# EAGLE board PIO-Dev-3 (EAGLE 9.5.2), part 1 of 2
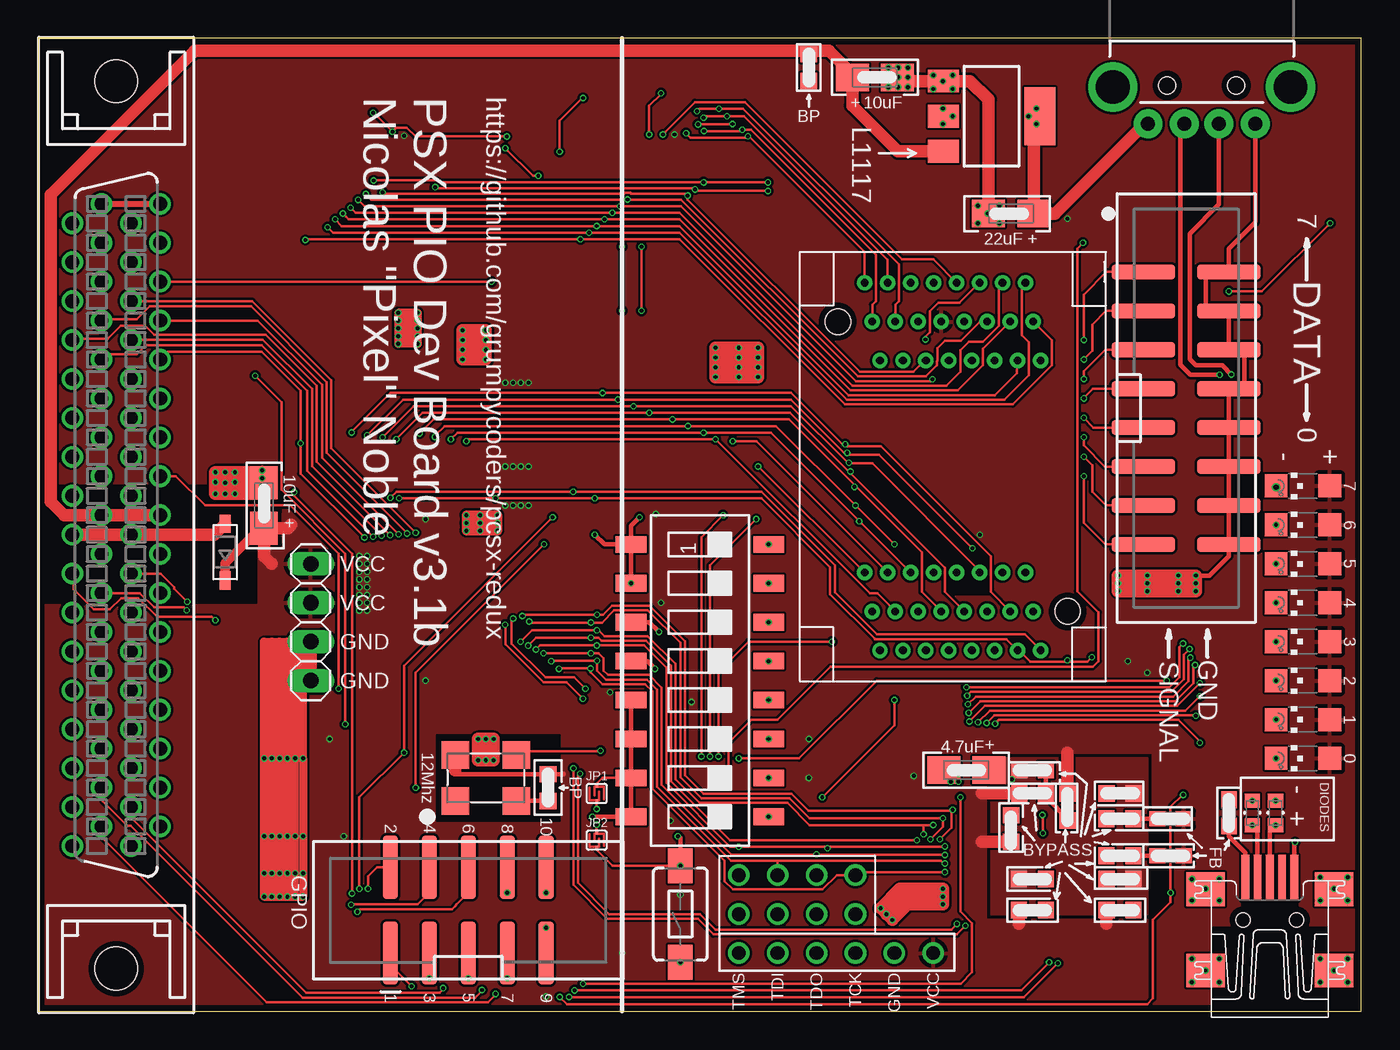
[diagram p3: board, top side]
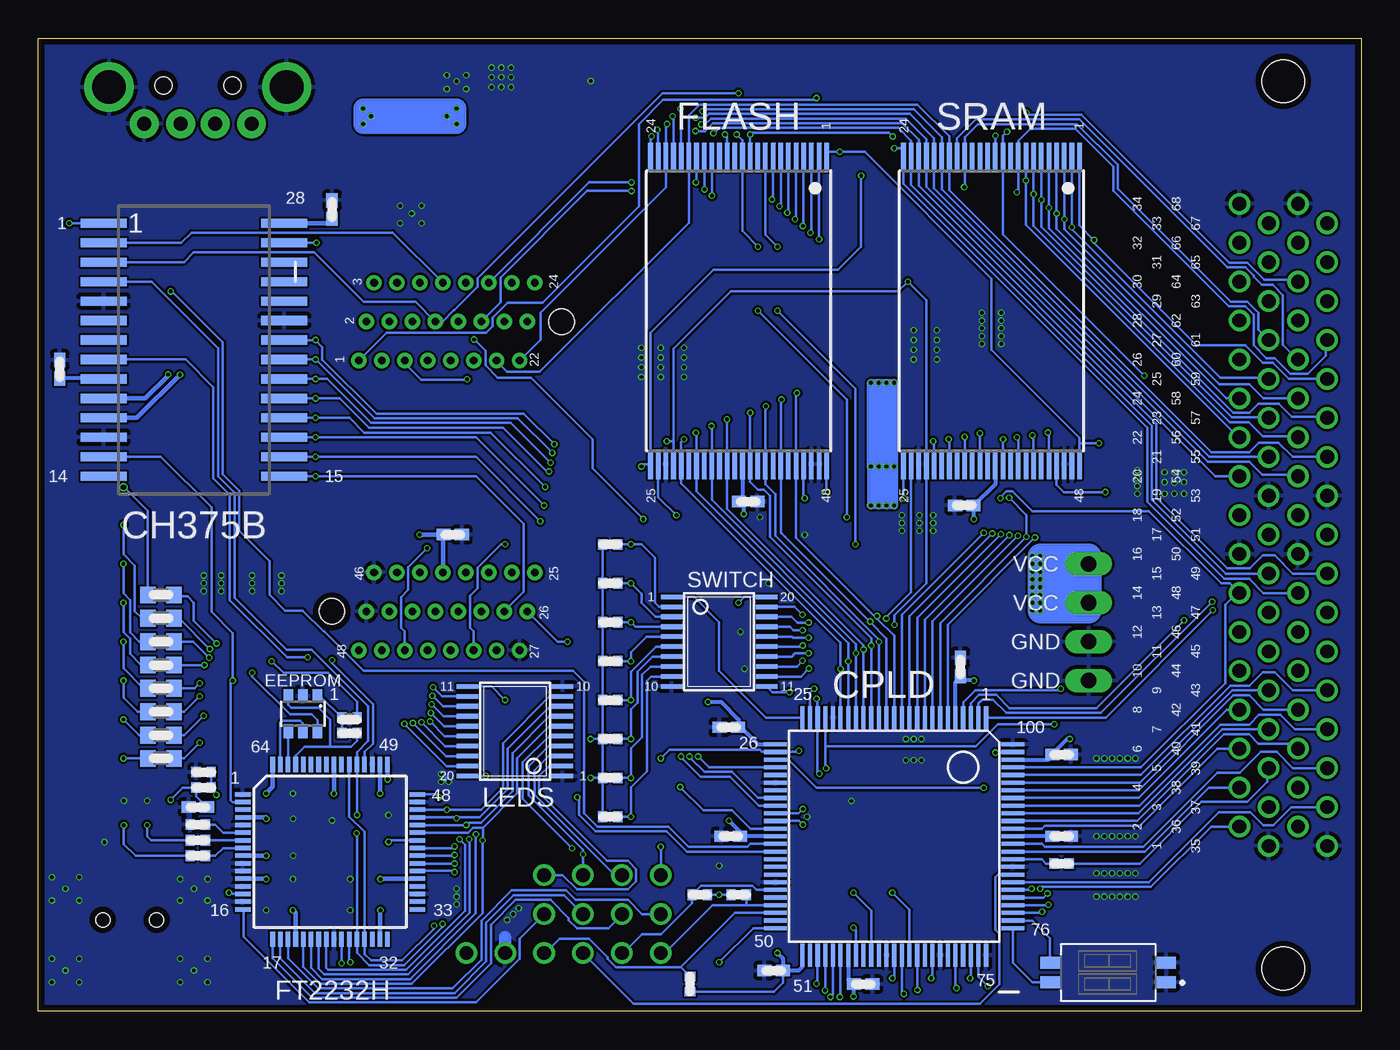
[diagram p4: board, bottom side, seen from below]

Size 86.36 x 63.5 mm. Coordinates in mm from the lower left corner, seen from the top.
Outline: 0,0 86.36,0 86.36,63.5 0,63.5 0,0
Copper layers (1*16): Top 0.035mm / dielectric 1.6mm / Bottom 0.035mm
Design rules "default *": minimum track width 6mil, minimum drill 0.2mm, track to track 6mil, track to pad 6mil, pad to pad 6mil, via to via 6mil, smd to smd 0mil, copper to edge 0.4mm, drill to drill 6mil, minimum pad ring 10mil, minimum via ring 3mil, stop-mask expansion 4mil, vias tented up to drill 25mil, thermal gap 10mil

## Footprints (pad centres in the part's own frame; a part is rotated, then mirrored left to right if it is on the bottom)
C0402K = smd 0.925 x 0.74: 1 -0.6,0; 2 0.6,0
A/3216-18W = smd 2.15 x 1.8: + 1.475,0; - -1.475,0
C0603K = smd 1.05 x 1.08: 1 -0.875,0; 2 0.875,0
SOP28-LL = smd 0.6 x 3: 1 -8.255,-5.9; 2 -6.985,-5.9; 3 -5.715,-5.9; 4 -4.445,-5.9; 5 -3.175,-5.9; 6 -1.905,-5.9; 7 -0.635,-5.9; 8 0.635,-5.9; 9 1.905,-5.9; 10 3.175,-5.9; 11 4.445,-5.9; 12 5.715,-5.9; 13 6.985,-5.9; 14 8.255,-5.9; 15 8.255,5.9; 16 6.985,5.9; 17 5.715,5.9; 18 4.445,5.9; 19 3.175,5.9; 20 1.905,5.9; 21 0.635,5.9; 22 -0.635,5.9; 23 -1.905,5.9; 24 -3.175,5.9; 25 -4.445,5.9; 26 -5.715,5.9; 27 -6.985,5.9; 28 -8.255,5.9
TQFP100 = smd 0.27 x 1.5: 1 -6,-7.75; 2 -5.5,-7.75; 3 -5,-7.75; 4 -4.5,-7.75; 5 -4,-7.75; 6 -3.5,-7.75; 7 -3,-7.75; 8 -2.5,-7.75; 9 -2,-7.75; 10 -1.5,-7.75; 11 -1,-7.75; 12 -0.5,-7.75; 13 0,-7.75; 14 0.5,-7.75; 15 1,-7.75; 16 1.5,-7.75; 17 2,-7.75; 18 2.5,-7.75; 19 3,-7.75; 20 3.5,-7.75; 21 4,-7.75; 22 4.5,-7.75; 23 5,-7.75; 24 5.5,-7.75; 25 6,-7.75; 51 6,7.75; 52 5.5,7.75; 53 5,7.75; 54 4.5,7.75; 55 4,7.75; 56 3.5,7.75; 57 3,7.75; 58 2.5,7.75; 59 2,7.75; 60 1.5,7.75; 61 1,7.75; 62 0.5,7.75; 63 0,7.75; 64 -0.5,7.75; 65 -1,7.75; 66 -1.5,7.75; 67 -2,7.75; 68 -2.5,7.75; 69 -3,7.75; 70 -3.5,7.75; 71 -4,7.75; 72 -4.5,7.75; 73 -5,7.75; 74 -5.5,7.75; 75 -6,7.75 | smd 1.5 x 0.27: 26 7.75,-6; 27 7.75,-5.5; 28 7.75,-5; 29 7.75,-4.5; 30 7.75,-4; 31 7.75,-3.5; 32 7.75,-3; 33 7.75,-2.5; 34 7.75,-2; 35 7.75,-1.5; 36 7.75,-1; 37 7.75,-0.5; 38 7.75,0; 39 7.75,0.5; 40 7.75,1; 41 7.75,1.5; 42 7.75,2; 43 7.75,2.5; 44 7.75,3; 45 7.75,3.5; 46 7.75,4; 47 7.75,4.5; 48 7.75,5; 49 7.75,5.5; 50 7.75,6; 76 -7.75,6; 77 -7.75,5.5; 78 -7.75,5; 79 -7.75,4.5; 80 -7.75,4; 81 -7.75,3.5; 82 -7.75,3; 83 -7.75,2.5; 84 -7.75,2; 85 -7.75,1.5; 86 -7.75,1; 87 -7.75,0.5; 88 -7.75,0; 89 -7.75,-0.5; 90 -7.75,-1; 91 -7.75,-1.5; 92 -7.75,-2; 93 -7.75,-2.5; 94 -7.75,-3; 95 -7.75,-3.5; 96 -7.75,-4; 97 -7.75,-4.5; 98 -7.75,-5; 99 -7.75,-5.5; 100 -7.75,-6
WE-VE_0603 = smd 0.9 x 1: 1 -0.8,0; 2 0.8,0
SOD-123 = smd 1.2 x 0.7: A 1.85,0; C -1.85,0
SOT23-6 = smd 0.6 x 0.9: 1 -0.95,-1.15; 2 0,-1.15; 3 0.95,-1.15; 4 0.95,1.15; 5 0,1.15; 6 -0.95,1.15
0603 = smd 1.1 x 1: 1 -0.85,0; 2 0.85,0
TSOP48-LL = smd 1.9 x 0.3: 1 -10.025,5.75; 2 -10.025,5.25; 3 -10.025,4.75; 4 -10.025,4.25; 5 -10.025,3.75; 6 -10.025,3.25; 7 -10.025,2.75; 8 -10.025,2.25; 9 -10.025,1.75; 10 -10.025,1.25; 11 -10.025,0.75; 12 -10.025,0.25; 13 -10.025,-0.25; 14 -10.025,-0.75; 15 -10.025,-1.25; 16 -10.025,-1.75; 17 -10.025,-2.25; 18 -10.025,-2.75; 19 -10.025,-3.25; 20 -10.025,-3.75; 21 -10.025,-4.25; 22 -10.025,-4.75; 23 -10.025,-5.25; 24 -10.025,-5.75; 25 10.025,-5.75; 26 10.025,-5.25; 27 10.025,-4.75; 28 10.025,-4.25; 29 10.025,-3.75; 30 10.025,-3.25; 31 10.025,-2.75; 32 10.025,-2.25; 33 10.025,-1.75; 34 10.025,-1.25; 35 10.025,-0.75; 36 10.025,-0.25; 37 10.025,0.25; 38 10.025,0.75; 39 10.025,1.25; 40 10.025,1.75; 41 10.025,2.25; 42 10.025,2.75; 43 10.025,3.25; 44 10.025,3.75; 45 10.025,4.25; 46 10.025,4.75; 47 10.025,5.25; 48 10.025,5.75
TSOP48-ADAPTER = drill 0.5 pad 0.754: P$1 -6.915,5.75; P$2 -9.455,5.25; P$3 -11.995,4.75; P$4 -6.915,4.25; P$5 -9.455,3.75; P$6 -11.995,3.25; P$7 -6.915,2.75; P$8 -9.455,2.25; P$9 -11.995,1.75; P$10 -6.915,1.25; P$11 -9.455,0.75; P$12 -11.995,0.25; P$13 -6.915,-0.25; P$14 -9.455,-0.75; P$15 -11.995,-1.25; P$16 -6.915,-1.75; P$17 -9.455,-2.25; P$18 -11.995,-2.75; P$19 -6.915,-3.25; P$20 -9.455,-3.75; P$21 -11.995,-4.25; P$22 -6.915,-4.75; P$23 -9.455,-5.25; P$24 -11.995,-5.75; P$25 6.915,-5.75; P$26 9.455,-5.25; P$27 11.995,-4.75; P$28 6.915,-4.25; P$29 9.455,-3.75; P$30 11.995,-3.25; P$31 6.915,-2.75; P$32 9.455,-2.25; P$33 11.995,-1.75; P$34 6.915,-1.25; P$35 9.455,-0.75; P$36 11.995,-0.25; P$37 6.915,0.25; P$38 9.455,0.75; P$39 11.995,1.25; P$40 6.915,1.75; P$41 9.455,2.25; P$42 11.995,2.75; P$43 6.915,3.25; P$44 9.455,3.75; P$45 11.995,4.25; P$46 6.915,4.75; P$47 9.455,5.25; P$48 11.995,5.75 | hole 1.65: 9.455,7.5; -9.455,-7.5
VQFP64 = smd 1 x 0.3: 1 -5.7,3.75; 2 -5.7,3.25; 3 -5.7,2.75; 4 -5.7,2.25; 5 -5.7,1.75; 6 -5.7,1.25; 7 -5.7,0.75; 8 -5.7,0.25; 9 -5.7,-0.25; 10 -5.7,-0.75; 11 -5.7,-1.25; 12 -5.7,-1.75; 13 -5.7,-2.25; 14 -5.7,-2.75; 15 -5.7,-3.25; 16 -5.7,-3.75; 33 5.7,-3.75; 34 5.7,-3.25; 35 5.7,-2.75; 36 5.7,-2.25; 37 5.7,-1.75; 38 5.7,-1.25; 39 5.7,-0.75; 40 5.7,-0.25; 41 5.7,0.25; 42 5.7,0.75; 43 5.7,1.25; 44 5.7,1.75; 45 5.7,2.25; 46 5.7,2.75; 47 5.7,3.25; 48 5.7,3.75 | smd 0.3 x 1: 17 -3.75,-5.7; 18 -3.25,-5.7; 19 -2.75,-5.7; 20 -2.25,-5.7; 21 -1.75,-5.7; 22 -1.25,-5.7; 23 -0.75,-5.7; 24 -0.25,-5.7; 25 0.25,-5.7; 26 0.75,-5.7; 27 1.25,-5.7; 28 1.75,-5.7; 29 2.25,-5.7; 30 2.75,-5.7; 31 3.25,-5.7; 32 3.75,-5.7; 49 3.75,5.7; 50 3.25,5.7; 51 2.75,5.7; 52 2.25,5.7; 53 1.75,5.7; 54 1.25,5.7; 55 0.75,5.7; 56 0.25,5.7; 57 -0.25,5.7; 58 -0.75,5.7; 59 -1.25,5.7; 60 -1.75,5.7; 61 -2.25,5.7; 62 -2.75,5.7; 63 -3.25,5.7; 64 -3.75,5.7
SOT223 = smd 1.5 x 2: 1 -2.3,-3.15; 2 0,-3.15; 3 2.3,-3.15 | smd 3.8 x 2: 4 0,3.15
2X8-SHROUDED_SMD = smd 4.15 x 1: 1 -2.794,8.89; 2 2.794,8.89; 3 -2.794,6.35; 4 2.794,6.35; 5 -2.794,3.81; 6 2.794,3.81; 7 -2.794,1.27; 8 2.794,1.27; 9 -2.794,-1.27; 10 2.794,-1.27; 11 -2.794,-3.81; 12 2.794,-3.81; 13 -2.794,-6.35; 14 2.794,-6.35; 15 -2.794,-8.89; 16 2.794,-8.89
2X5-SHROUDED_SMD = smd 4.15 x 1: 1 -2.794,5.08; 2 2.794,5.08; 3 -2.794,2.54; 4 2.794,2.54; 5 -2.794,0; 6 2.794,0; 7 -2.794,-2.54; 8 2.794,-2.54; 9 -2.794,-5.08; 10 2.794,-5.08
USB-A-H = drill 0.914 pad 1.88: D+ 2.4,1.127; D- 2.4,-1.127; GND 2.4,3.5; VBUS 2.4,-3.5 | drill 2.2: SHLD1 0,-5.8; SHLD2 0,5.8 | hole 1.1: -0.1,2.25; -0.1,-2.25
1X04 = drill 1.016 long: 1 -3.81,0; 2 -1.27,0; 3 1.27,0; 4 3.81,0
CHIPLED_1206 = smd 1.5 x 1.5: A 0,-1.75; C 0,1.75
TSSOP20-LL = smd 0.3 x 1.4: 1 -2.925,-3.1; 2 -2.275,-3.1; 3 -1.625,-3.1; 4 -0.975,-3.1; 5 -0.325,-3.1; 6 0.325,-3.1; 7 0.975,-3.1; 8 1.625,-3.1; 9 2.275,-3.1; 10 2.925,-3.1; 11 2.925,3.1; 12 2.275,3.1; 13 1.625,3.1; 14 0.975,3.1; 15 0.325,3.1; 16 -0.325,3.1; 17 -0.975,3.1; 18 -1.625,3.1; 19 -2.275,3.1; 20 -2.925,3.1
PIOCONN = drill 0.9 pad 1.27: 1 20.955,0.953; 2 19.685,2.863; 3 18.415,0.953; 4 17.145,2.863; 5 15.875,0.953; 6 14.605,2.863; 7 13.335,0.953; 8 12.065,2.863; 9 10.795,0.953; 10 9.525,2.863; 11 8.255,0.953; 12 6.985,2.863; 13 5.715,0.953; 14 4.445,2.863; 15 3.175,0.953; 16 1.905,2.863; 17 0.635,0.953; 18 -0.635,2.863; 19 -1.905,0.953; 20 -3.175,2.863; 21 -4.445,0.953; 22 -5.715,2.863; 23 -6.985,0.953; 24 -8.255,2.863; 25 -9.525,0.953; 26 -10.795,2.863; 27 -12.065,0.953; 28 -13.335,2.863; 29 -14.605,0.953; 30 -15.875,2.863; 31 -17.145,0.953; 32 -18.415,2.863; 33 -19.685,0.953; 34 -20.955,2.863; 35 20.955,-2.867; 36 19.685,-0.957; 37 18.415,-2.867; 38 17.145,-0.957; 39 15.875,-2.867; 40 14.605,-0.957; 41 13.335,-2.867; 42 12.065,-0.957; 43 10.795,-2.867; 44 9.525,-0.957; 45 8.255,-2.867; 46 6.985,-0.957; 47 5.715,-2.867; 48 4.445,-0.957; 49 3.175,-2.867; 50 1.905,-0.957; 51 0.635,-2.867; 52 -0.635,-0.957; 53 -1.905,-2.867; 54 -3.175,-0.957; 55 -4.445,-2.867; 56 -5.715,-0.957; 57 -6.985,-2.867; 58 -8.255,-0.957; 59 -9.525,-2.867; 60 -10.795,-0.957; 61 -12.065,-2.867; 62 -13.335,-0.957; 63 -14.605,-2.867; 64 -15.875,-0.957; 65 -17.145,-2.867; 66 -18.415,-0.957; 67 -19.685,-2.867; 68 -20.955,-0.957 | hole 2.8: -28.955,0; 28.955,0
R0402 = smd 0.6 x 0.7: 1 -0.5,0; 2 0.5,0
R0603 = smd 1 x 1.1: 1 -0.85,0; 2 0.85,0
SMS-008 = smd 1.092 x 2.007: 1 -8.89,-4.496; 2 -6.35,-4.496; 3 -3.81,-4.496; 4 -1.27,-4.496; 5 1.27,-4.496; 6 3.81,-4.496; 7 6.35,-4.496; 8 8.89,-4.496; 9 8.89,4.496; 10 6.35,4.496; 11 3.81,4.496; 12 1.27,4.496; 13 -1.27,4.496; 14 -3.81,4.496; 15 -6.35,4.496; 16 -8.89,4.496
TACTILE_SWITCH_SMD_6.0X3.5MM = smd 2.3 x 1.6: 1 -3.15,0; 2 3.15,0
1571983-3 = smd 0.76 x 1.27: 1 -0.635,-3.795; 1-1 -0.635,3.795; 2 0.635,-3.795; 2-1 0.635,3.795
JTAGSWITCH = drill 0.9 pad 1.27: GND -3.81,-6.35; P0 -1.27,3.81; P1 -1.27,1.27; P2 -1.27,-1.27; P3 -1.27,-3.81; P4 1.27,-3.81; P5 1.27,-1.27; P6 1.27,1.27; P7 1.27,3.81; TCK -3.81,-3.81; TDI -3.81,1.27; TDO -3.81,-1.27; TMS -3.81,3.81; VCC -3.81,-8.89
RESONATOR = smd 1.8 x 1.8: P1 -2,-1.5; P2 2,-1.5; P3 2,1.5; P4 -2,1.5
SMD-JUMPER = smd 0.254 x 0.152: P$1 -0.508,0; P$2 0.508,0
UX60-MB-5ST = smd 3 x 0.5: 1 2.75,1.6; 2 2.75,0.8; 3 2.75,0; 4 2.75,-0.8; 5 2.75,-1.6 | smd 2.2 x 2.5: M1 -3.3,-4.2; M2 -3.3,4.2; M3 2,4.2; M4 2,-4.2 | hole 0.9: 0,-1.75; 0,1.75

## Placement (x,y rotation side)
C1  100nF  [C0402K]  19.56,11.43 0 bottom
C2  100nF  [C0402K]  19.56,16.76 0 bottom
C3  100nF  [C0402K]  26.16,22.48 90 bottom
C4  100nF  [C0402K]  41.27,18.54 180 bottom
C5  100nF  [C0402K]  41.15,11.43 180 bottom
C6  100nF  [C0402K]  38.35,2.67 180 bottom
C7  100nF  [C0402K]  32.51,1.78 0 bottom
C8  10uF  [A/3216-18W]  14.73,33.02 270 top
C9  100nF  [C0402K]  25.91,33.02 180 bottom
C10  100nF  [C0402K]  40.01,33.27 0 bottom
C11  100nF  [C0402K]  59.31,31.11 0 bottom
C12  100nF  [C0603K]  64.9,8.64 0 top
C13  100nF  [C0603K]  70.61,8.64 180 top
C14  100nF  [C0603K]  70.61,14.22 180 top
C15  100nF  [C0603K]  64.9,6.6 0 top
C16  100nF  [C0603K]  70.61,6.6 0 top
C17  100nF  [C0603K]  63.5,11.94 90 top
C18  100nF  [C0603K]  67.18,13.34 270 top
C19  100nF  [C0603K]  64.91,15.75 0 top
C20  100nF  [C0603K]  64.91,14.22 0 top
C21  4.7uF  [A/3216-18W]  60.58,15.75 0 top
C22  100nF  [C0603K]  70.6,10.16 180 top
C23  100nF  [C0603K]  70.6,12.57 180 top
C24  10nF  [C0402K]  75.95,13.34 180 bottom
C25  100nF  [C0402K]  67.18,52.32 90 bottom
C26  10uF  [A/3216-18W]  54.61,60.96 180 top
C27  22uF  [A/3216-18W]  63.5,52.07 0 top
C28  100nF  [C0603K]  50.29,61.59 270 top
C29  100nF  [C0402K]  84.96,41.91 90 bottom
C30  100nF  [C0603K]  33.27,14.61 270 top
CH  CH375B  [SOP28-LL]  76.2,43.18 270 bottom
CPLD  XC95144XL-100  [TQFP100]  30.48,11.43 180 bottom
D1  5V  [WE-VE_0603]  80.77,12.95 90 top
D2  5V  [WE-VE_0603]  79.25,12.95 90 top
D3  [SOD-123]  12.19,29.97 90 top
EEPROM  93LC76B  [SOT23-6]  69.09,19.43 180 bottom
FB1  30Ω/1.8A  [0603]  73.91,10.16 180 top
FB2  30Ω/1.8A  [0603]  73.91,12.57 180 top
FB3  30Ω/1.8A  [0603]  77.72,12.95 90 top
FLASH  16MBITFLASHLONGLEAD  [TSOP48-LL]  40.64,45.72 270 bottom
FLASH-SOCKET  16MBITFLASHSOCKET  [TSOP48-ADAPTER]  59.69,35.56 270 top
FT2232H  FT2232HVQFP64  [VQFP64]  67.31,10.41 0 bottom
IC2  LD117AS50TR  [SOT223]  62.23,58.42 270 top
J1  [2X8-SHROUDED_SMD]  74.93,39.37 0 top
J2  [2X5-SHROUDED_SMD]  28.07,6.6 90 top
J3  USB_A_PTH_MALE  [USB-A-H]  75.95,60.33 270 top
JP1  [1X04]  17.78,25.4 270 top
LED1  [CHIPLED_1206]  82.55,16.51 90 top
LED2  [CHIPLED_1206]  82.55,19.05 90 top
LED3  [CHIPLED_1206]  82.55,21.59 90 top
LED4  [CHIPLED_1206]  82.55,24.13 90 top
LED5  [CHIPLED_1206]  82.55,26.67 90 top
LED6  [CHIPLED_1206]  82.55,29.21 90 top
LED7  [CHIPLED_1206]  82.55,31.75 90 top
LED8  [CHIPLED_1206]  82.55,34.29 90 top
LEDS  74LVC573APW  [TSSOP20-LL]  55.24,18.29 90 bottom
PIO  PIOCONNPIOCONN-S  [PIOCONN]  5.08,31.75 270 top
R1  200  [R0402]  19.56,9.65 0 bottom
R2  4.7k  [R0402]  49.02,12.7 180 bottom
R3  4.7k  [R0402]  49.02,15.24 180 bottom
R4  4.7k  [R0402]  49.02,17.78 180 bottom
R5  4.7k  [R0402]  49.02,20.32 180 bottom
R6  4.7k  [R0402]  49.02,22.86 180 bottom
R7  4.7k  [R0402]  49.02,25.4 180 bottom
R8  4.7k  [R0402]  49.02,27.94 180 bottom
R9  4.7k  [R0402]  49.02,30.48 180 bottom
R10  10k  [R0402]  66.04,19.18 0 bottom
R11  2k  [R0402]  66.04,18.16 0 bottom
R12  10  [R0402]  75.95,11.18 0 bottom
R13  10  [R0402]  75.95,10.16 0 bottom
R14  12k  [R0402]  75.95,12.19 0 bottom
R15  15k  [R0402]  75.56,14.61 180 bottom
R16  10k  [R0402]  75.56,15.62 0 bottom
R17  56  [R0603]  78.36,27.18 0 bottom
R18  56  [R0603]  78.36,25.65 0 bottom
R19  56  [R0603]  78.36,24.13 0 bottom
R20  56  [R0603]  78.36,22.61 0 bottom
R21  56  [R0603]  78.36,21.08 0 bottom
R22  56  [R0603]  78.36,19.56 0 bottom
R23  56  [R0603]  78.36,18.03 0 bottom
R24  56  [R0603]  78.36,16.51 0 bottom
R25  4.7k  [R0402]  43.81,1.78 270 bottom
R26  4.7k  [R0402]  43.18,7.62 0 bottom
R27  4.7k  [R0402]  40.64,7.62 180 bottom
S1  SWS008  [SMS-008]  43.18,21.59 270 top
S2  MOMENTARY-SWITCH-SPST-SMD-6.0X3.5MM  [TACTILE_SWITCH_SMD_6.0X3.5MM]  41.91,6.35 90 top
SRAM  CY62167EV30LL  [TSOP48-LL]  24.13,45.72 270 bottom
SW1  1571983-3  [1571983-3]  16.51,2.54 90 bottom
SWITCH  74LVC573APW  [TSSOP20-LL]  41.91,24.13 270 bottom
U$1  JTAGSWITCH  [JTAGSWITCH]  49.53,7.62 90 top
U$2  RESONATOR  [RESONATOR]  29.21,15.24 0 top
U$3  SMD-JUMPER  [SMD-JUMPER]  36.45,14.22 90 top
U$4  SMD-JUMPER  [SMD-JUMPER]  36.45,11.18 270 top
X1  MINI-USB-SHIELD-UX60-MB-5ST  [UX60-MB-5ST]  80.39,5.97 90 top